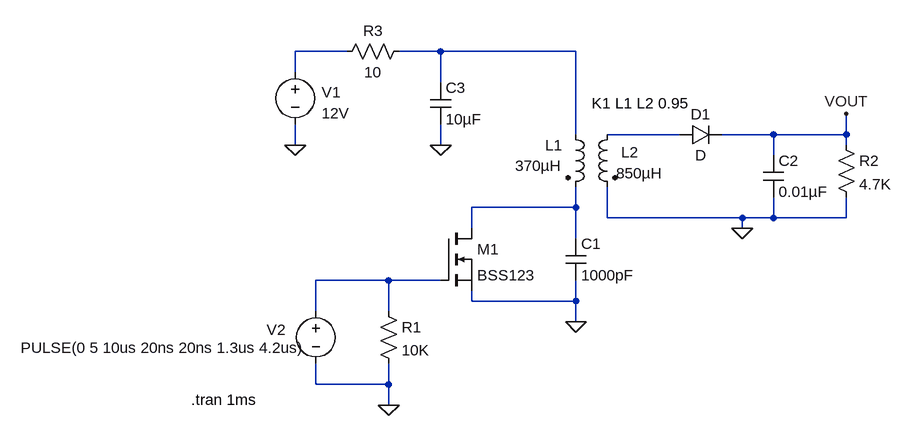
[diagram p0: schematic IGBT Drive.asc]
IGBT Drive.asc, the LTspice schematic file:
Version 4
SHEET 1 880 680
WIRE -128 16 -208 16
WIRE 16 16 -48 16
WIRE 224 16 16 16
WIRE -208 48 -208 16
WIRE 16 64 16 16
WIRE 224 144 224 16
WIRE 384 144 272 144
WIRE 528 144 448 144
WIRE 640 144 640 112
WIRE 640 144 528 144
WIRE -208 160 -208 128
WIRE 16 160 16 128
WIRE 640 160 640 144
WIRE 528 176 528 144
WIRE 224 256 224 224
WIRE 224 256 64 256
WIRE 272 272 272 224
WIRE 480 272 272 272
WIRE 528 272 528 240
WIRE 528 272 480 272
WIRE 640 272 640 240
WIRE 640 272 528 272
WIRE 64 288 64 256
WIRE 480 288 480 272
WIRE 224 304 224 256
WIRE -64 368 -176 368
WIRE 16 368 -64 368
WIRE 64 400 64 384
WIRE 224 400 224 368
WIRE 224 400 64 400
WIRE -176 416 -176 368
WIRE -64 416 -64 368
WIRE 224 432 224 400
WIRE -176 528 -176 496
WIRE -64 528 -64 496
WIRE -64 528 -176 528
WIRE -64 560 -64 528
FLAG 224 432 0
FLAG 480 288 0
FLAG -208 160 0
FLAG -64 560 0
FLAG 640 112 VOUT
FLAG 16 160 0
SYMBOL ind2 208 128 R0
WINDOW 0 -31 32 Left 2
WINDOW 3 -77 64 Left 2
SYMATTR InstName L1
SYMATTR Value 370µH
SYMATTR Type ind
SYMBOL ind2 288 128 M0
WINDOW 0 -33 43 Left 2
WINDOW 3 -69 75 Left 2
SYMATTR InstName L2
SYMATTR Value 850µH
SYMATTR Type ind
SYMBOL voltage -208 32 R0
WINDOW 0 41 47 Left 2
WINDOW 3 41 79 Left 2
SYMATTR InstName V1
SYMATTR Value 12V
SYMBOL nmos 16 288 R0
SYMATTR InstName M1
SYMATTR Value BSS123
SYMBOL cap 208 304 R0
SYMATTR InstName C1
SYMATTR Value 1000pF
SYMBOL res -80 400 R0
SYMATTR InstName R1
SYMATTR Value 10K
SYMBOL voltage -176 400 R0
WINDOW 0 -76 44 Left 2
WINDOW 3 -454 72 Left 2
WINDOW 123 0 0 Left 2
WINDOW 39 0 0 Left 2
SYMATTR InstName V2
SYMATTR Value PULSE(0 5 10us 20ns 20ns 1.3us 4.2us)
SYMBOL diode 384 160 R270
WINDOW 0 32 32 VTop 2
WINDOW 3 0 32 VBottom 2
SYMATTR InstName D1
SYMBOL res 624 144 R0
SYMATTR InstName R2
SYMATTR Value 4.7K
SYMBOL cap 512 176 R0
SYMATTR InstName C2
SYMATTR Value 0.01µF
SYMBOL cap 0 64 R0
SYMATTR InstName C3
SYMATTR Value 10µF
SYMBOL res -144 32 R270
WINDOW 0 32 56 VTop 2
WINDOW 3 0 56 VBottom 2
SYMATTR InstName R3
SYMATTR Value 10
TEXT 248 96 Left 2 !K1 L1 L2 0.95
TEXT -368 552 Left 2 !.tran 1ms

The netlist it stands for:
* IGBT Drive.asc
L1 N002 N004 370µH
L2 N003 0 850µH
V1 N001 0 12V
M1 N004 N005 0 0 BSS123
C1 N004 0 1000pF
R1 N005 0 10K
V2 N005 0 PULSE(0 5 10us 20ns 20ns 1.3us 4.2us)
D1 N003 VOUT D
R2 VOUT 0 4.7K
C2 VOUT 0 0.01µF
C3 N002 0 10µF
R3 N001 N002 10
.model D D
.lib standard.dio
.model NMOS NMOS
.model PMOS PMOS
.lib standard.mos
K1 L1 L2 0.95
.tran 1ms
.backanno
.end